# EAGLE design rx08-ulrich (EAGLE 6.6.0)
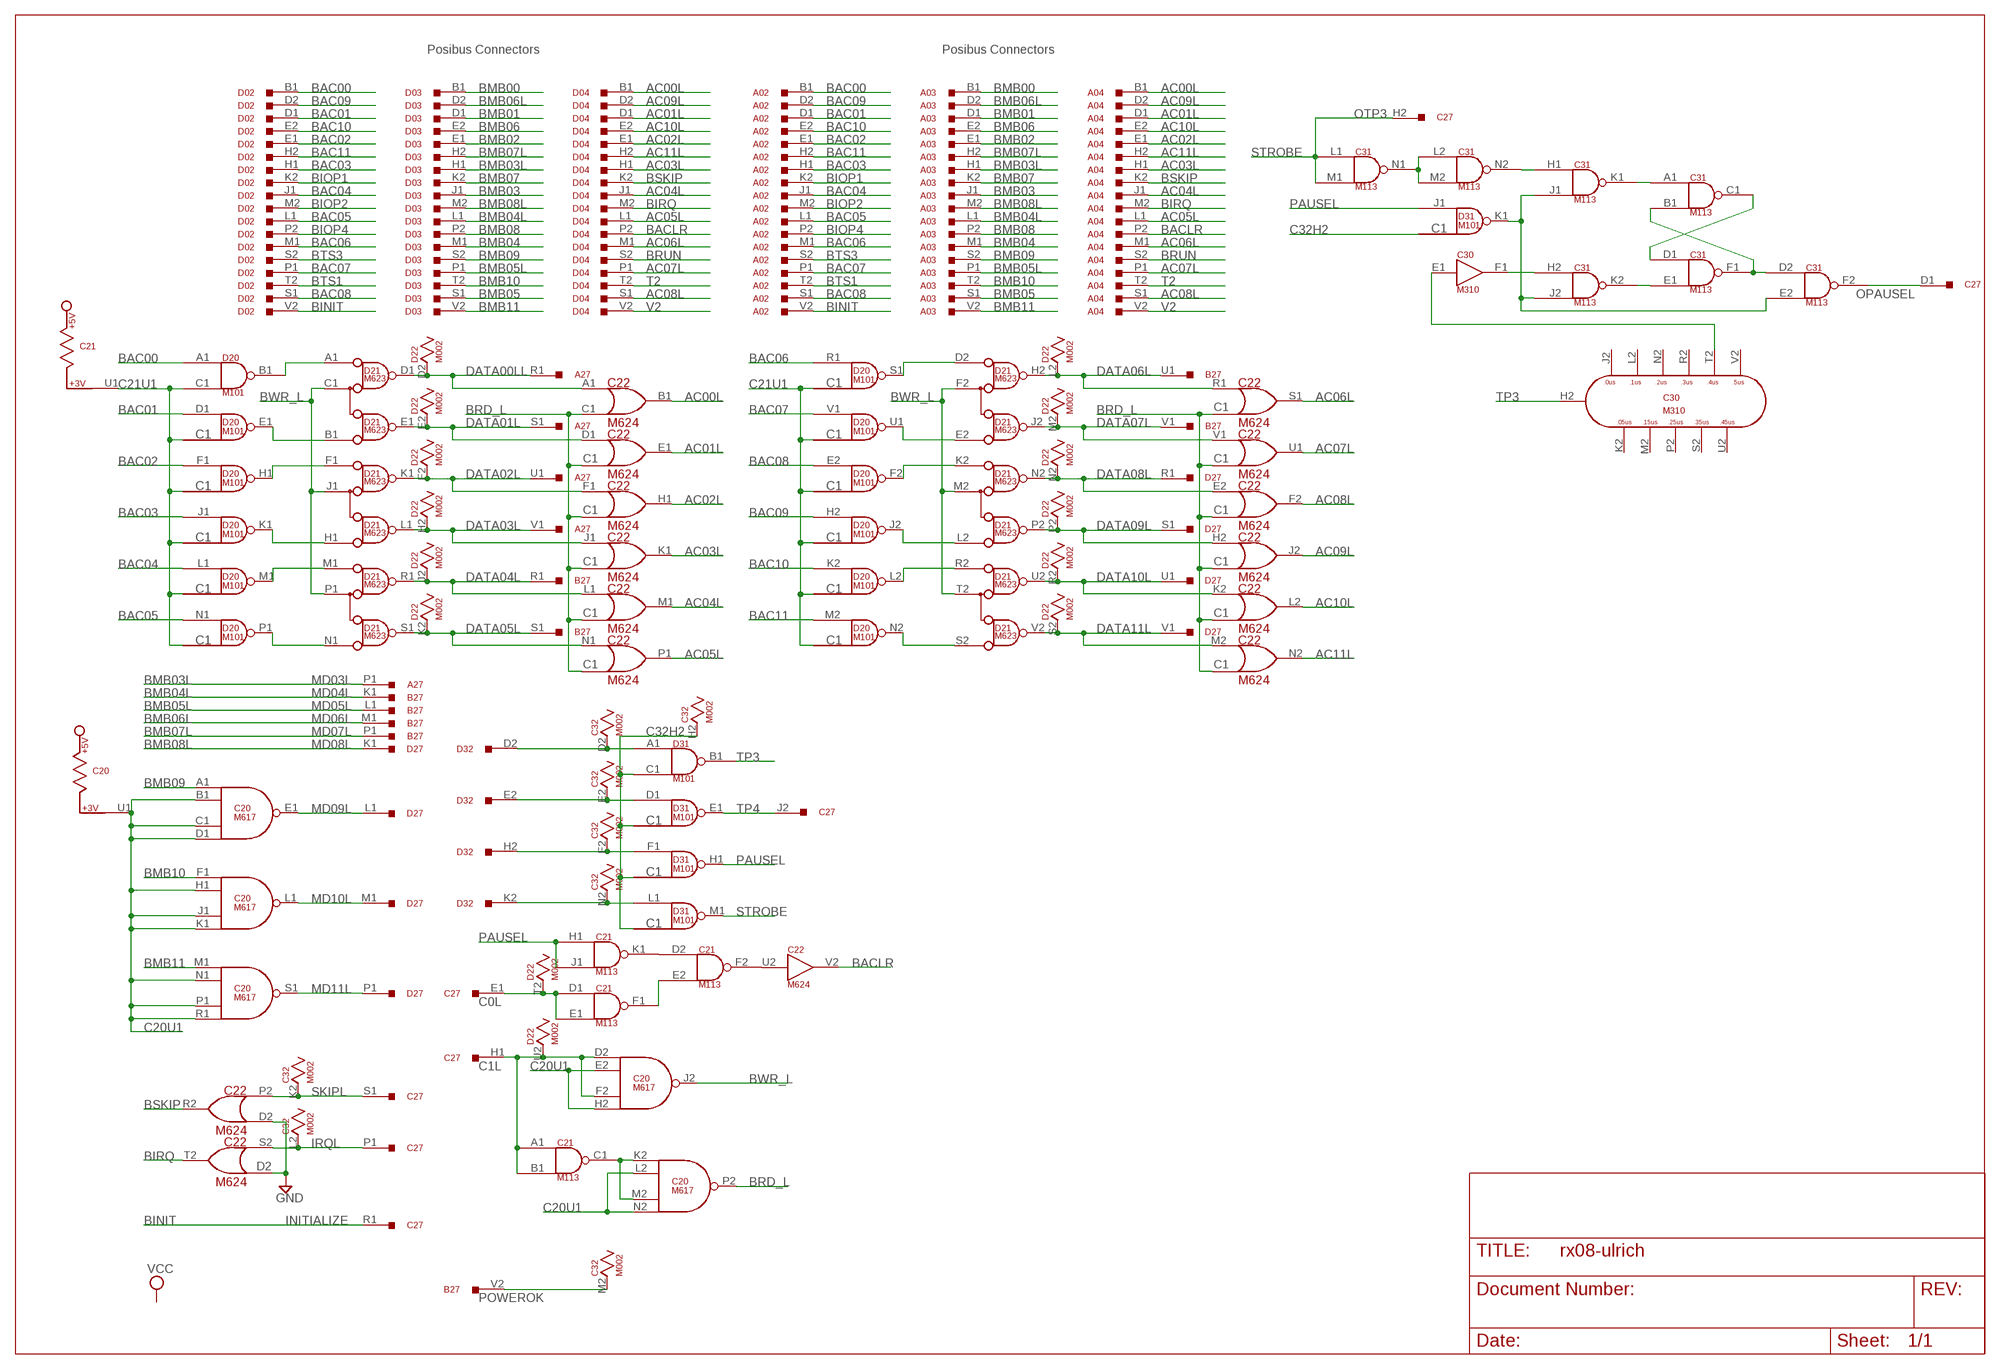
[diagram p0: schematic, sheet 1]

## Parts
A02  M903  [H807]
A03  M903  [H807]
A04  M903  [H807]
A27  M916  [H807]
B27  M916  [H807]
C20  M617  [H807]
C21  M113  [H807]
C22  M624  [H807]
C27  M916  [H807]
C30  M310  [H807]
C31  M113  [H807]
C32  M002  [H807]
D02  M903  [H807]
D03  M903  [H807]
D04  M903  [H807]
D20  M101  [H807]
D21  M623  [H807]
D22  M002  [H807]
D27  M916  [H807]
D31  M101  [H807]
D32  M903  [H807]

## Nets
AC00L: A04.B1 C22.B1(B1:OUT) D04.B1
AC01L: A04.D1 C22.E1(E1:OUT) D04.D1
AC02L: A04.E1 C22.H1(H1:OUT) D04.E1
AC03L: A04.H1 C22.K1(K1:OUT) D04.H1
AC04L: A04.J1 C22.M1(M1:OUT) D04.J1
AC05L: A04.L1 C22.P1(P1:OUT) D04.L1
AC06L: A04.M1 C22.S1(S1:OUT) D04.M1
AC07L: A04.P1 C22.U1(U1:OUT) D04.P1
AC08L: A04.S1 C22.F2(F2:OUT) D04.S1
AC09L: A04.D2 C22.J2(J2:OUT) D04.D2
AC10L: A04.E2 C22.L2(L2:OUT) D04.E2
AC11L: A04.H2 C22.N2(N2:OUT) D04.H2
BAC00: A02.B1 D02.B1 D20.A1(B1:IN1)
BAC01: A02.D1 D02.D1 D20.D1(E1:IN)
BAC02: A02.E1 D02.E1 D20.F1(H1:IN)
BAC03: A02.H1 D02.H1 D20.J1(K1:IN)
BAC04: A02.J1 D02.J1 D20.L1(M1:IN)
BAC05: A02.L1 D02.L1 D20.N1(P1:IN)
BAC06: A02.M1 D02.M1 D20.R1(S1:IN)
BAC07: A02.P1 D02.P1 D20.V1(U1:IN)
BAC08: A02.S1 D02.S1 D20.E2(F2:IN)
BAC09: A02.D2 D02.D2 D20.H2(J2:IN)
BAC10: A02.E2 D02.E2 D20.K2(L2:IN)
BAC11: A02.H2 D02.H2 D20.M2(N2:IN)
BACLR: A04.P2 C22.V2(V2:OUT) D04.P2
BINIT: A02.V2 C27.R1 D02.V2
BIOP1: A02.K2 D02.K2
BIOP2: A02.M2 D02.M2
BIOP4: A02.P2 D02.P2
BIRQ: A04.M2 C22.T2(T2:OUT) D04.M2
BMB00: A03.B1 D03.B1
BMB01: A03.D1 D03.D1
BMB02: A03.E1 D03.E1
BMB03: A03.J1 D03.J1
BMB03L: A03.H1 A27.P1 D03.H1
BMB04: A03.M1 D03.M1
BMB04L: A03.L1 B27.K1 D03.L1
BMB05: A03.S1 D03.S1
BMB05L: A03.P1 B27.L1 D03.P1
BMB06: A03.E2 D03.E2
BMB06L: A03.D2 B27.M1 D03.D2
BMB07: A03.K2 D03.K2
BMB07L: A03.H2 B27.P1 D03.H2
BMB08: A03.P2 D03.P2
BMB08L: A03.M2 D03.M2 D27.K1
BMB09: A03.S2 C20.A1(E1:IN1) D03.S2
BMB10: A03.T2 C20.F1(L1:IN1) D03.T2
BMB11: A03.V2 C20.M1(S1:IN1) D03.V2
BRD_L: C20.P2(P2:OUT) C22.C1(B1:IN2)
BRUN: A04.S2 D04.S2
BSKIP: A04.K2 C22.R2(R2:OUT) D04.K2
BTS1: A02.T2 D02.T2
BTS3: A02.S2 D02.S2
BWR_L: C20.J2(J2:OUT) D21.C1(D1:C) D21.F2(H2:C) D21.J1(K1:C) D21.M2(N2:C) D21.P1(R1:C) D21.T2(U2:C)
C0L: C21.D1(F1:IN1) C21.E1(F1:IN2) C27.E1 D22.T2
C1L: C20.D2(J2:IN1) C20.F2(J2:IN3) C21.A1(C1:IN1) C21.B1(C1:IN2) C27.H1 D22.U2
C20U1: C20.B1(E1:IN2) C20.C1(E1:IN3) C20.D1(E1:IN4) C20.E2(J2:IN2) C20.H1(L1:IN2) C20.H2(J2:IN4) C20.J1(L1:IN3) C20.K1(L1:IN4) C20.L2(P2:IN2) C20.N1(S1:IN2) C20.N2(P2:IN4) C20.P1(S1:IN3) C20.R1(S1:IN4) C20.U1
C21U1: C21.U1 D20.C1(B1:IN2)
C32H2: C32.H2 D31.C1(B1:IN2)
DATA00LL: A27.R1 C22.A1(B1:IN1) D21.D1(D1:D) D22.D2
DATA01L: A27.S1 C22.D1(E1:IN) D21.E1(D1:E) D22.E2
DATA02L: A27.U1 C22.F1(H1:IN) D21.K1(K1:D) D22.F2
DATA03L: A27.V1 C22.J1(K1:IN) D21.L1(K1:E) D22.H2
DATA04L: B27.R1 C22.L1(M1:IN) D21.R1(R1:D) D22.J2
DATA05L: B27.S1 C22.N1(P1:IN) D21.S1(R1:E) D22.K2
DATA06L: B27.U1 C22.R1(S1:IN) D21.H2(H2:D) D22.L2
DATA07L: B27.V1 C22.V1(U1:IN) D21.J2(H2:E) D22.M2
DATA08L: C22.E2(F2:IN) D21.N2(N2:D) D22.N2 D27.R1
DATA09L: C22.H2(J2:IN) D21.P2(N2:E) D22.P2 D27.S1
DATA10L: C22.K2(L2:IN) D21.U2(U2:D) D22.R2 D27.U1
DATA11L: C22.M2(N2:IN) D21.V2(U2:E) D22.S2 D27.V1
GND: C22.D2(R2:IN2)
IRQL: C22.S2(T2:IN) C27.P1 C32.L2
MD09L: C20.E1(E1:OUT) D27.L1
MD10L: C20.L1(L1:OUT) D27.M1
MD11L: C20.S1(S1:OUT) D27.P1
N$1: D20.B1(B1:OUT) D21.A1(D1:A)
N$2: D20.E1(E1:OUT) D21.B1(D1:B)
N$3: D20.H1(H1:OUT) D21.F1(K1:A)
N$4: D20.K1(K1:OUT) D21.H1(K1:B)
N$5: D20.P1(P1:OUT) D21.N1(R1:B)
N$6: D20.M1(M1:OUT) D21.M1(R1:A)
N$7: C20.K2(P2:IN1) C20.M2(P2:IN3) C21.C1(C1:OUT)
N$8: D20.N2(N2:OUT) D21.S2(U2:B)
N$9: C32.D2 D31.A1(B1:IN1) D32.D2
N$10: D20.J2(J2:OUT) D21.L2(N2:B)
N$11: D20.U1(U1:OUT) D21.E2(H2:B)
N$12: D20.S1(S1:OUT) D21.D2(H2:A)
N$13: D20.F2(F2:OUT) D21.K2(N2:A)
N$14: D20.L2(L2:OUT) D21.R2(U2:A)
N$15: C32.E2 D31.D1(E1:IN) D32.E2
N$16: C32.F2 D31.F1(H1:IN) D32.H2
N$17: C32.N2 D31.L1(M1:IN) D32.K2
N$18: C31.E2(F2:IN2) C31.J1(K1:IN2) C31.J2(K2:IN2) D31.K1(K1:OUT)
N$19: C21.E2(F2:IN2) C21.F1(F1:OUT)
N$20: C21.D2(F2:IN1) C21.K1(K1:OUT)
N$21: C31.C1(C1:OUT) C31.D1(F1:IN1)
N$22: C31.B1(C1:IN2) C31.D2(F2:IN1) C31.F1(F1:OUT)
N$23: C21.F2(F2:OUT) C22.U2(V2:IN)
N$24: C30.E1(F1:IN) C30.T2(H2:T2)
N$25: C30.F1(F1:OUT) C31.H2(K2:IN1)
N$26: C31.L2(N2:IN1) C31.M2(N2:IN2) C31.N1(N1:OUT)
N$28: C31.H1(K1:IN1) C31.N2(N2:OUT)
N$29: C31.A1(C1:IN1) C31.K1(K1:OUT)
N$30: C31.E1(F1:IN2) C31.K2(K2:OUT)
OPAUSEL: C27.D1 C31.F2(F2:OUT)
PAUSEL: C21.H1(K1:IN1) C21.J1(K1:IN2) D31.H1(H1:OUT) D31.J1(K1:IN)
POWEROK: B27.V2 C32.M2
SKIPL: C22.P2(R2:IN1) C27.S1 C32.K2
STROBE: C27.H2 C31.L1(N1:IN1) C31.M1(N1:IN2) D31.M1(M1:OUT)
T2: A04.T2 D04.T2
TP3: C30.H2(H2:H2) D31.B1(B1:OUT)
TP4: C27.J2 D31.E1(E1:OUT)
V2: A04.V2 D04.V2
Unconnected: A27.A1 A27.A2 A27.B1 A27.B2 A27.C1 A27.C2 A27.D1 A27.D2 A27.E1 A27.E2 A27.F1 A27.F2 A27.H1 A27.H2 A27.J1 A27.J2 A27.K1 A27.K2 A27.L1 A27.L2 A27.M1 A27.M2 A27.N1 A27.N2 A27.P2 A27.R2 A27.S2 A27.T1 A27.T2 A27.U2 A27.V2 B27.A1 B27.A2 B27.B1 B27.B2 B27.C1 B27.C2 B27.D1 B27.D2 B27.E1 B27.E2 B27.F1 B27.F2 B27.H1 B27.H2 B27.J1 B27.J2 B27.K2 B27.L2 B27.M2 B27.N1 B27.N2 B27.P2 B27.R2 B27.S2 B27.T1 B27.T2 B27.U2 C20.R2(V2:IN1) C20.S2(V2:IN2) C20.T2(V2:IN3) C20.U2(V2:IN4) C20.V1 C20.V2(V2:OUT) C21.H2(K2:IN1) C21.J2(K2:IN2) C21.K2(K2:OUT) C21.L1(N1:IN1) C21.L2(N2:IN1) C21.M1(N1:IN2) C21.M2(N2:IN2) C21.N1(N1:OUT) C21.N2(N2:OUT) C21.P1(S1:IN1) C21.P2(S2:IN1) C21.R1(S1:IN2) C21.R2(S2:IN2) C21.S1(S1:OUT) C21.S2(S2:OUT) C21.T2(V2:IN1) C21.U2(V2:IN2) C21.V1 C21.V2(V2:OUT) C27.A1 C27.A2 C27.B1 C27.B2 C27.C1 C27.C2 C27.D2 C27.E2 C27.F1 C27.F2 C27.J1 C27.K1 C27.K2 C27.L1 C27.L2 C27.M1 C27.M2 C27.N1 C27.N2 C27.P2 C27.R2 C27.S2 C27.T1 C27.T2 C27.U1 C27.U2 C27.V1 C27.V2 C30.H1(J1:IN) C30.J1(J1:OUT) C30.J2(H2:J2) C30.K2(H2:K2) C30.L2(H2:L2) C30.M2(H2:M2) C30.N2(H2:N2) C30.P2(H2:P2) C30.R2(H2:R2) C30.S2(H2:S2) C30.U2(H2:U2) C30.V2(H2:V2) C31.P1(S1:IN1) C31.P2(S2:IN1) C31.R1(S1:IN2) C31.R2(S2:IN2) C31.S1(S1:OUT) C31.S2(S2:OUT) C31.T2(V2:IN1) C31.U1 C31.U2(V2:IN2) C31.V1 C31.V2(V2:OUT) C32.J2 C32.P2 C32.R2 C32.S2 C32.T2 C32.U2 C32.V2 D20.P2(R2:IN) D20.R2(R2:OUT) D20.S2(T2:IN) D20.T2(T2:OUT) D20.U2(V2:IN) D20.V2(V2:OUT) D22.V2 D27.A1 D27.A2 D27.B1 D27.B2 D27.C1 D27.C2 D27.D1 D27.D2 D27.E1 D27.E2 D27.F1 D27.F2 D27.H1 D27.H2 D27.J1 D27.J2 D27.K2 D27.L2 D27.M2 D27.N1 D27.N2 D27.P2 D27.R2 D27.S2 D27.T1 D27.T2 D27.U2 D27.V2 D31.E2(F2:IN) D31.F2(F2:OUT) D31.H2(J2:IN) D31.J2(J2:OUT) D31.K2(L2:IN) D31.L2(L2:OUT) D31.M2(N2:IN) D31.N1(P1:IN) D31.N2(N2:OUT) D31.P1(P1:OUT) D31.P2(R2:IN) D31.R1(S1:IN) D31.R2(R2:OUT) D31.S1(S1:OUT) D31.S2(T2:IN) D31.T2(T2:OUT) D31.U1(U1:OUT) D31.U2(V2:IN) D31.V1(U1:IN) D31.V2(V2:OUT) D32.B1 D32.D1 D32.E1 D32.H1 D32.J1 D32.L1 D32.M1 D32.M2 D32.P1 D32.P2 D32.S1 D32.S2 D32.T2 D32.V2

## Notes on the sheet
- Posibus Connectors | Posibus Connectors
- OTP3
- MD03L
- MD04L
- MD05L
- MD06L
- MD07L
- MD08L
- INITIALIZE

## Power pins joined to a net without a drawn wire
GND: A02.A1 A02.C1 A02.C2 A02.F1 A02.F2 A02.J2 A02.K1 A02.L2 A02.N1 A02.N2 A02.R1 A02.R2 A02.T1 A02.U2 A03.A1 A03.C1 A03.C2 A03.F1 A03.F2 A03.J2 A03.K1 A03.L2 A03.N1 A03.N2 A03.R1 A03.R2 A03.T1 A03.U2 A04.A1 A04.C1 A04.C2 A04.F1 A04.F2 A04.J2 A04.K1 A04.L2 A04.N1 A04.N2 A04.R1 A04.R2 A04.T1 A04.U2 C20.C2(GND) C20.T1(GND) C21.C2(GND) C21.T1(GND) C22.C2(GND) C22.T1(GND) C30.C2(GND) C30.T1(GND) C31.C2(GND) C31.T1(GND) C32.C2(GND) D02.A1 D02.C1 D02.C2 D02.F1 D02.F2 D02.J2 D02.K1 D02.L2 D02.N1 D02.N2 D02.R1 D02.R2 D02.T1 D02.U2 D03.A1 D03.C1 D03.C2 D03.F1 D03.F2 D03.J2 D03.K1 D03.L2 D03.N1 D03.N2 D03.R1 D03.R2 D03.T1 D03.U2 D04.A1 D04.C1 D04.C2 D04.F1 D04.F2 D04.J2 D04.K1 D04.L2 D04.N1 D04.N2 D04.R1 D04.R2 D04.T1 D04.U2 D20.C2(GND) D20.T1(GND) D21.C2(GND) D21.T1(GND) D21.U1(GND) D21.V1(GND) D22.C2(GND) D31.C2(GND) D31.T1(GND) D32.A1 D32.C1 D32.C2 D32.F1 D32.F2 D32.J2 D32.K1 D32.L2 D32.N1 D32.N2 D32.R1 D32.R2 D32.T1 D32.U2
VCC: C20.A2(VCC) C21.A2(VCC) C22.A2(VCC) C30.A2(VCC) C31.A2(VCC) C32.A2(VCC) D20.A2(VCC) D21.A2(VCC) D22.A2(VCC) D31.A2(VCC)

## Library data of the parts
A02-A04 D02-D04 D32 = dec-m:M903: Two-sided Posibus cable/connector.
A27 B27 C27 D27 = dec-m:M916: Simple 36 pin connector/wire cable
C20 = dec-m:M617: 6 4-input NAND Buffers
C21 C31 = dec-m:M113: 10 2-input NAND Gates
C22 = dec-m:M624: Bus Data Interface The M101 contains 15 two-input NAND gates. One input of each gate is tied to a common line so that all data signals can be enabled simultaneously. Each data signal presents one TTL load. The common input presents 15 loads. Each output can drive 10 loads. Power: 5V@82ma (max.)
C30 = dec-m:M310: Tapped Delay Line
C32 D22 = dec-m:M002: 15 Clamped Loads
D20 D31 = dec-m:M101: Bus Data Interface The M101 contains 15 two-input NAND gates. One input of each gate is tied to a common line so that all data signals can be enabled simultaneously. Each data signal presents one TTL load. The common input presents 15 loads. Each output can drive 10 loads. Power: 5V@82ma (max.)
D21 = dec-m:M623: 6 Dual Bus Drivers

## Net classes
1 Supply: width 1.905 mm, clearance 0.508 mm

## Board
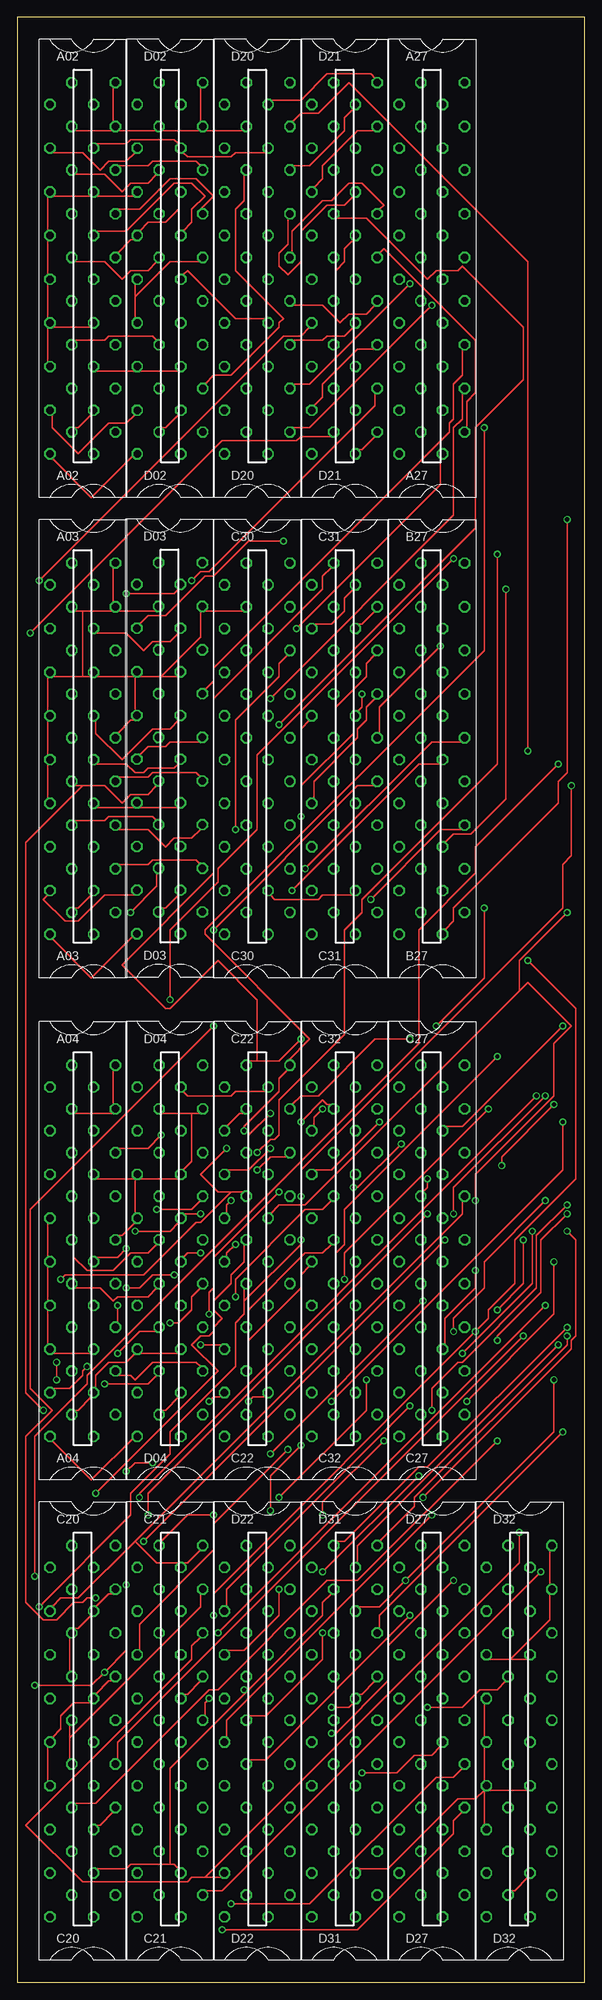
[diagram p1: board, top side]
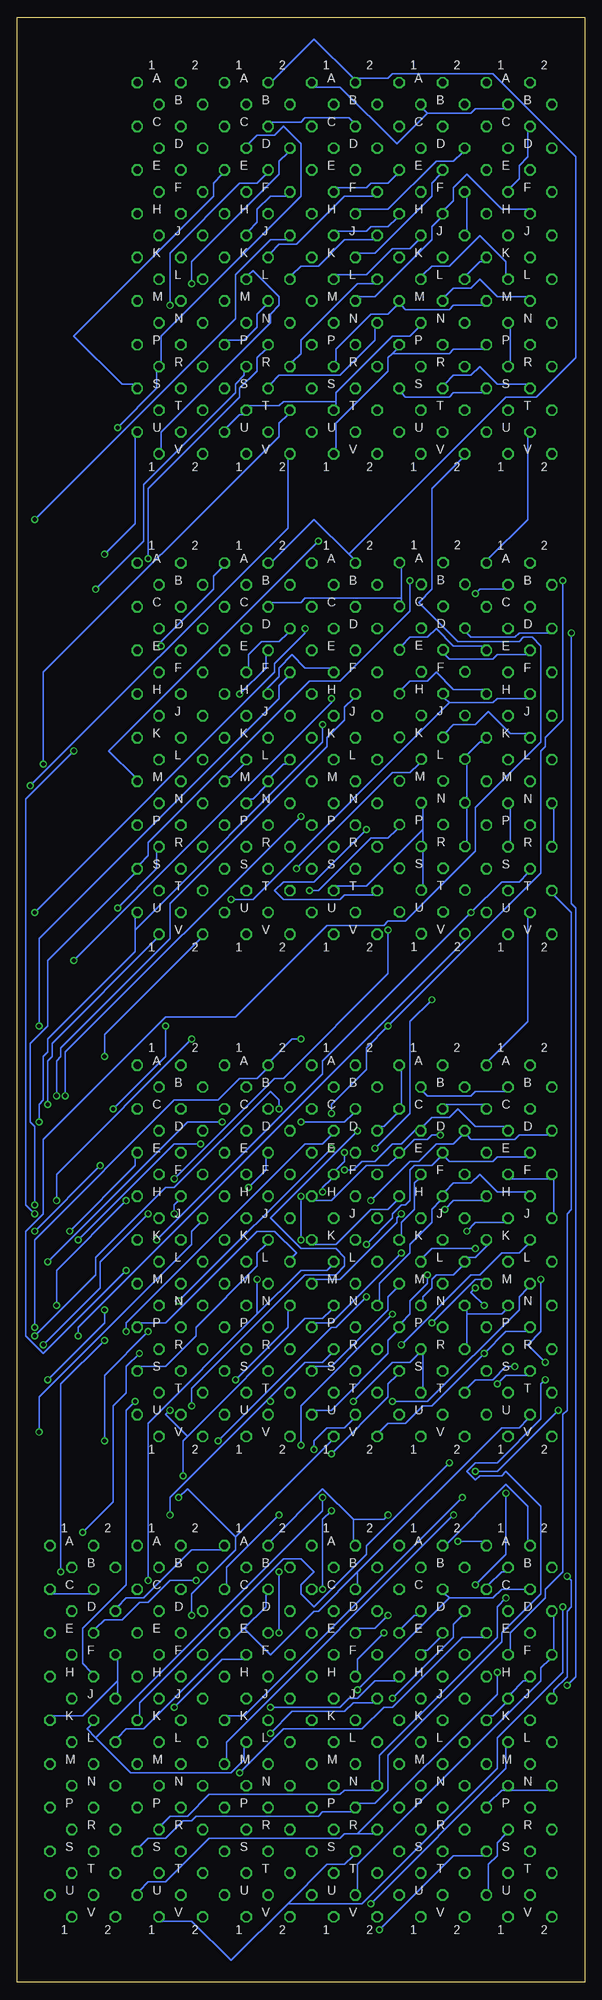
[diagram p2: board, bottom side, seen from below]

Size 82.55 x 285.75 mm. Coordinates in mm from the lower left corner, seen from the top.
Outline: 0,0 82.55,0 82.55,285.75 0,285.75 0,0
Copper layers (1*16): Top 0.035mm / dielectric 1.5mm / Bottom 0.035mm
Design rules "olimex10mil": minimum track width 10mil, minimum drill 24mil, track to track 10mil, track to pad 10mil, pad to pad 10mil, via to via 10mil, smd to smd 10mil, copper to edge 40mil, drill to drill 10mil, minimum pad ring 10mil, minimum via ring 8mil, stop-mask expansion 0mil, vias tented up to drill 0mil, thermal gap 10mil

### Footprints (pad centres in the part's own frame; a part is rotated, then mirrored left to right if it is on the bottom)
H807 = drill 1.092 octagon: A1 4.763,28.575; A2 -1.587,28.575; B1 1.587,25.4; B2 -4.763,25.4; C1 4.763,22.225; C2 -1.587,22.225; D1 1.587,19.05; D2 -4.763,19.05; E1 4.763,15.875; E2 -1.587,15.875; F1 1.587,12.7; F2 -4.763,12.7; H1 4.763,9.525; H2 -1.587,9.525; J1 1.587,6.35; J2 -4.763,6.35; K1 4.763,3.175; K2 -1.587,3.175; L1 1.587,0; L2 -4.763,0; M1 4.763,-3.175; M2 -1.587,-3.175; N1 1.587,-6.35; N2 -4.763,-6.35; P1 4.763,-9.525; P2 -1.587,-9.525; R1 1.587,-12.7; R2 -4.763,-12.7; S1 4.763,-15.875; S2 -1.587,-15.875; T1 1.587,-19.05; T2 -4.763,-19.05; U1 4.763,-22.225; U2 -1.587,-22.225; V1 1.587,-25.4; V2 -4.763,-25.4

### Placement (x,y rotation side)
A02  9.53,247.65 0 top
A03  9.53,177.8 0 top
A04  9.53,104.78 0 top
A27  60.33,247.65 0 top
B27  60.33,177.8 0 top
C20  9.53,34.92 0 top
C21  22.23,34.92 0 top
C22  34.92,104.78 0 top
C27  60.33,104.78 0 top
C30  34.92,177.8 0 top
C31  47.62,177.8 0 top
C32  47.62,104.78 0 top
D02  22.23,247.65 0 top
D03  22.16,177.86 0 top
D04  22.23,104.78 0 top
D20  34.92,247.65 0 top
D21  47.62,247.65 0 top
D22  34.92,34.92 0 top
D27  60.33,34.92 0 top
D31  47.62,34.92 0 top
D32  73.03,34.92 0 top

### Tracks (layer width: path | path; a pad name or v marks a point on that pad's centre or on a via)
AC00L
  Top 0.254: C22.B1 36.2,129.54 31.75,129.54 31.11,128.91 24.77,128.91 24.13,129.54 D04.B1
  Bottom 0.254: A04.B1 11.43,129.54 15.88,129.54 16.51,128.91 22.86,128.91 23.5,129.54 D04.B1
AC01L  (via drill 0.61)
  Top 0.254: v34.92,118.11 36.83,120.02 39.37,120.02 C22.E1
  Bottom 0.254: A04.D1 11.43,124.46 15.88,124.46 18.41,127 19.68,125.73 22.23,125.73 23.5,124.46 D04.D1 24.13,124.46 26.67,121.92 27.94,121.92 30.48,119.38 32.38,119.38 33.66,118.11 v34.92,118.11
AC02L  (via drill 0.61)
  Top 0.254: v20.95,123.19 19.05,121.28 14.61,121.28 A04.E1
  Bottom 0.254: v20.95,123.19 22.23,123.19 22.86,122.56 24.77,122.56 26.67,120.65 D04.E1 27.3,120.02 28.57,118.75 31.75,118.75 36.83,113.67 39.37,113.67 C22.H1
AC03L  (via drill 0.61)
  Top 0.254: v20.32,112.39 25.4,112.39 26.67,113.67 D04.H1
  Bottom 0.254: v20.32,112.39 19.05,113.67 14.61,113.67 A04.H1 | C22.K1 39.37,107.31 36.2,107.31 31.11,112.39 28.57,112.39 27.3,113.67 D04.H1
AC04L  (via drill 0.61)
  Top 0.254: v17.14,109.22 22.23,109.22 23.5,110.49 D04.J1 24.13,111.76 v26.67,111.76
  Bottom 0.254: v17.14,109.22 15.88,110.49 11.43,110.49 A04.J1 | v26.67,111.76 27.3,111.12 27.3,110.49 35.56,102.23 39.37,102.23 C22.M1
AC05L  (via drill 0.61)
  Top 0.254: v15.88,106.68 14.61,105.41 11.43,105.41 A04.L1 | v26.67,106.05 24.77,106.05 24.13,105.41 D04.L1
  Bottom 0.254: v15.88,106.68 22.23,106.68 23.5,105.41 D04.L1 | v26.67,106.05 36.83,95.89 39.37,95.89 C22.P1
AC06L  (via drill 0.61)
  Top 0.254: v22.23,95.89 23.5,95.89 25.4,97.79 25.4,99.69 26.67,100.97 D04.M1
  Bottom 0.254: v22.23,95.89 15.88,102.23 14.61,102.23 A04.M1 | C22.S1 39.37,89.53 36.83,89.53 28.57,97.79 28.57,99.69 27.3,100.97 D04.M1
AC07L  (via drill 0.61)
  Top 0.254: v14.61,98.42 14.61,95.89 A04.P1 | v15.88,100.97 17.78,100.97 19.68,102.87 v22.86,102.87
  Bottom 0.254: v14.61,98.42 16.51,100.33 v15.88,100.97 | v22.86,102.87 22.86,101.6 25.4,99.06 25.4,97.16 26.67,95.89 D04.P1 27.3,94.61 28.57,93.34 28.57,91.44 36.83,83.19 39.37,83.19 C22.U1
AC08L  (via drill 0.61)
  Top 0.254: A04.S1 14.61,88.27 16.51,88.27 17.14,87.63 19.68,90.17 26.04,90.17 26.67,89.53 D04.S1 | v36.83,121.28 33.66,118.11 30.48,118.11 C22.F2 | v36.83,76.83 v59.05,99.06
  Bottom 0.254: v59.05,99.06 v36.83,121.28 | v36.83,76.83 28.57,85.09 28.57,87 27.3,88.27 D04.S1
AC09L  (via drill 0.61)
  Top 0.254: v31.11,113.67 30.48,113.03 30.48,111.76 C22.J2
  Bottom 0.254: A04.D2 5.08,123.19 9.53,123.19 10.16,122.56 16.51,122.56 17.14,123.19 D04.D2 17.78,123.19 19.05,121.92 21.59,121.92 24.13,119.38 25.4,119.38 v31.11,113.67
AC10L  (via drill 0.61)
  Top 0.254: v31.75,107.31 30.48,106.05 30.48,105.41 C22.L2
  Bottom 0.254: A04.E2 8.26,120.02 12.7,120.02 13.34,119.38 19.68,119.38 20.32,120.02 D04.E2 20.95,120.02 22.23,118.75 24.77,118.75 25.4,118.11 25.4,113.67 26.04,113.03 26.67,113.03 27.94,111.76 27.94,111.12 v31.75,107.31
AC11L
  Bottom 0.254: A04.H2 8.26,114.94 12.7,114.94 15.24,117.47 16.51,116.2 19.05,116.2 20.32,114.94 D04.H2 20.95,113.67 22.23,112.39 22.23,110.49 25.4,107.31 25.4,106.05 29.84,101.6 29.84,99.06 C22.N2
BAC00
  Bottom 0.254: 22.86,271.78 16.51,271.78 15.88,272.42 11.43,272.42 A02.B1 | 22.86,271.78 23.5,272.42 D02.B1 | 22.86,271.78 27.3,267.33 35.56,275.59 39.37,275.59 D20.A1
BAC01
  Top 0.254: A02.D1 11.43,267.33 15.88,267.33 16.51,267.97 22.86,267.97 23.5,267.33 D02.D1 24.13,266.06 24.77,265.43 31.11,265.43 31.75,266.06 36.2,266.06 D20.D1
BAC02
  Top 0.254: A02.E1 14.61,264.16 19.05,264.16 19.68,264.8 26.04,264.8 26.67,264.16 D02.E1
  Bottom 0.254: D20.F1 36.2,260.99 31.75,260.99 31.11,261.62 28.57,261.62 27.3,262.89 D02.E1
BAC03
  Top 0.254: A02.H1 14.61,257.81 17.78,257.81 22.23,262.25 26.04,262.25 28.57,259.71 26.67,257.81 D02.H1
  Bottom 0.254: D20.J1 36.2,254.63 31.75,254.63 31.11,255.27 28.57,255.27 27.3,256.54 D02.H1
BAC04
  Top 0.254: A02.J1 11.43,254.63 15.88,254.63 22.86,261.62 25.4,261.62 27.3,259.71 25.4,257.81 25.4,255.91 24.13,254.63 D02.J1
  Bottom 0.254: D20.L1 36.2,248.28 31.75,248.28 27.94,252.09 25.4,252.09 24.13,253.37 D02.J1
BAC05
  Top 0.254: D20.N1 36.2,241.94 31.75,241.94 24.77,248.92 24.13,248.28 D02.L1
  Bottom 0.254: A02.L1 11.43,248.28 11.43,250.19 15.24,254 19.68,249.56 22.23,249.56 23.5,248.28 D02.L1
BAC06
  Bottom 0.254: A02.M1 14.61,243.84 19.05,243.84 19.68,243.21 26.04,243.21 26.67,243.84 D02.M1 27.3,243.84 28.57,242.57 31.11,242.57 36.2,237.49 36.2,235.59 D20.R1
BAC07
  Bottom 0.254: 27.94,236.85 27.3,237.49 D02.P1 | 27.94,236.85 28.57,236.22 28.57,234.31 36.2,226.69 36.2,222.88 D20.V1 | 27.94,236.85 19.68,236.85 19.05,237.49 14.61,237.49 A02.P1
BAC08
  Top 0.254: D20.E2 33.02,262.89 33.02,259.08 31.75,257.81 31.75,248.92 38.73,241.94 38.1,241.3 38.1,240.66 31.11,233.68 28.57,233.68 27.3,232.41 D02.S1
  Bottom 0.254: A02.S1 14.61,231.14 19.05,231.14 19.68,230.5 26.04,230.5 26.67,231.14 D02.S1
BAC09
  Top 0.254: A02.D2 5.08,266.06 9.53,266.06 12.06,263.52 13.34,264.8 15.88,264.8 17.14,266.06 D02.D2
  Bottom 0.254: D20.H2 33.02,257.81 28.57,257.81 21.59,264.8 19.05,264.8 17.78,266.06 D02.D2
BAC10
  Top 0.254: A02.E2 8.26,262.89 12.7,262.89 15.24,260.35 16.51,261.62 19.05,261.62 20.32,262.89 D02.E2
  Bottom 0.254: D20.K2 33.02,251.46 30.48,251.46 22.23,259.71 22.23,261.62 20.95,262.89 D02.E2
BAC11
  Bottom 0.254: A02.H2 8.26,257.81 12.06,257.81 17.14,262.89 19.05,260.99 19.05,259.08 20.32,257.81 D02.H2 20.95,256.54 22.23,255.27 22.23,253.37 30.48,245.11 33.02,245.11 D20.M2
BACLR  (via drill 0.61)
  Top 0.254: v14.61,91.44 17.78,94.61 20.32,94.61 D04.P2
  Bottom 0.254: A04.P2 8.26,94.61 11.43,94.61 v14.61,91.44 22.23,83.82 23.5,83.82 26.04,81.28 28.57,81.28 29.84,80.01 C22.V2
BINIT  (via drill 0.61)
  Top 0.254: v66.67,103.5 66.67,100.97 62.23,96.52 62.23,92.71 C27.R1 | A02.V2 5.08,221.62 10.79,215.9 17.14,222.25 D02.V2
  Bottom 0.254: v66.67,103.5 78.74,91.44 81.28,93.98 81.28,109.22 78.74,111.76 78.74,122.56 60.96,140.34 50.8,140.34 37.47,153.67 29.21,153.67 28.57,154.31 26.04,154.31 15.88,164.47 15.88,170.81 6.35,180.34 6.35,194.31 7.62,195.58 8.89,195.58 9.53,194.94 18.41,194.94 24.13,200.66 22.23,202.56 22.23,217.17 17.78,221.62 D02.V2
BIOP1
  Top 0.254: A02.K2 8.26,250.19 12.7,250.19 15.24,247.65 16.51,248.92 19.05,248.92 20.32,250.19 D02.K2
BIOP2
  Bottom 0.254: A02.M2 8.26,245.11 12.7,245.11 15.24,247.65 16.51,246.38 19.05,246.38 20.32,245.11 D02.M2
BIOP4
  Top 0.254: A02.P2 8.26,238.76 12.7,238.76 13.34,239.4 19.68,239.4 20.32,238.76 D02.P2
BIRQ  (via drill 0.61)
  Top 0.254: A04.M2 8.26,100.97 12.06,100.97 13.97,99.06 14.61,99.69 19.05,99.69 20.32,100.97 D04.M2 | v27.94,84.45 28.57,85.09 29.84,85.09 C22.T2
  Bottom 0.254: v27.94,84.45 22.86,84.45 9.53,97.79 9.53,99.69 8.26,100.97 A04.M2
BMB00  (via drill 0.61)
  Top 0.254: v15.88,201.93 22.86,201.93 23.5,202.56 D03.B1
  Bottom 0.254: v15.88,201.93 15.24,202.56 11.43,202.56 A03.B1
BMB01
  Top 0.254: A03.D1 11.43,196.22 15.88,196.22 18.41,193.68 19.68,194.94 22.23,194.94 23.5,196.22 D03.D1
BMB02
  Bottom 0.254: A03.E1 14.61,194.31 19.05,194.31 21.59,196.85 22.86,195.58 25.4,195.58 26.67,194.31 D03.E1
BMB03
  Top 0.254: A03.J1 11.43,183.51 11.43,181.61 15.24,177.8 19.68,182.25 22.23,182.25 23.5,183.51 D03.J1
BMB03L
  Top 0.254: A27.P1 64.77,237.49 64.77,233.68 63.5,232.41 63.5,227.33 62.87,226.69 62.87,225.43 28.57,191.13 28.57,189.23 27.3,187.96 D03.H1
  Bottom 0.254: A03.H1 14.61,187.96 19.05,187.96 21.59,190.5 22.86,189.23 25.4,189.23 26.67,187.96 D03.H1
BMB04
  Top 0.254: A03.M1 14.61,175.26 19.05,175.26 19.68,175.9 26.04,175.9 26.67,175.26 D03.M1
BMB04L  (via drill 0.61)
  Top 0.254: A03.L1 11.43,177.16 15.88,177.16 17.14,175.9 18.41,175.9 19.05,176.53 22.86,176.53 23.5,177.16 D03.L1 | v41.91,161.93 60.33,180.34 64.77,180.34 B27.K1
  Bottom 0.254: v41.91,161.93 27.94,175.9 25.4,175.9 24.13,177.16 D03.L1
BMB05
  Top 0.254: A03.S1 14.61,162.56 19.05,162.56 19.68,163.19 26.04,163.19 26.67,162.56 D03.S1
BMB05L  (via drill 0.61)
  Top 0.254: A03.P1 14.61,167.64 19.05,167.64 21.59,165.1 22.86,166.37 25.4,166.37 26.67,167.64 D03.P1 | v40.01,158.75 58.42,177.16 61.59,177.16 B27.L1
  Bottom 0.254: v40.01,158.75 38.73,158.75 31.11,166.37 28.57,166.37 27.3,167.64 D03.P1
BMB06
  Bottom 0.254: A03.E2 8.26,193.04 12.7,193.04 13.34,192.41 19.68,192.41 20.32,193.04 D03.E2
BMB06L  (via drill 0.61)
  Top 0.254: v38.73,209.55 33.66,209.55 28.57,204.47 27.3,204.47 21.59,198.75 19.05,198.75 17.78,197.49 D03.D2
  Bottom 0.254: A03.D2 5.08,196.22 9.53,196.22 10.16,195.58 16.51,195.58 17.14,196.22 D03.D2 | v38.73,209.55 69.22,179.07 65.41,175.26 B27.M1
BMB07
  Bottom 0.254: A03.K2 8.26,181.61 10.79,181.61 13.97,184.78 15.88,182.88 19.05,182.88 20.32,181.61 D03.K2
BMB07L  (via drill 0.61)
  Top 0.254: v51.44,157.48 61.59,167.64 64.77,167.64 B27.P1
  Bottom 0.254: 19.68,186.06 13.34,186.06 12.7,186.69 8.26,186.69 A03.H2 | 19.68,186.06 20.32,186.69 D03.H2 | v51.44,157.48 48.26,157.48 19.68,186.06
BMB08
  Top 0.254: A03.P2 8.26,168.91 12.7,168.91 13.34,169.54 19.68,169.54 20.32,168.91 D03.P2
BMB08L  (via drill 0.61)
  Top 0.254: 9.53,173.99 12.7,173.99 15.24,171.45 16.51,172.72 19.05,172.72 20.32,173.99 D03.M2 | 9.53,173.99 8.26,173.99 A03.M2 | v19.68,75.56 17.14,75.56 v15.88,74.3 | v3.81,83.19 1.27,85.72 1.27,165.74 9.53,173.99
  Bottom 0.254: v19.68,75.56 31.75,63.5 31.75,62.23 39.37,54.61 41.27,56.52 41.27,57.78 39.37,59.69 41.27,61.59 43.81,61.59 64.77,40.64 64.77,38.73 D27.K1 | v15.88,74.3 12.7,74.3 v3.81,83.19
BMB09  (via drill 0.61)
  Top 0.254: v18.41,64.14 v62.23,107.95 | v16.51,155.57 20.32,159.38 20.32,161.29 D03.S2
  Bottom 0.254: v18.41,64.14 14.61,64.14 C20.A1 | v62.23,107.95 38.1,132.08 38.1,133.99 v16.51,155.57 12.06,160.02 9.53,160.02 8.26,161.29 A03.S2
BMB10
  Top 0.254: D03.T2 17.14,158.12 12.7,158.12 8.89,154.31 6.99,154.31 3.81,157.48 4.45,158.12 A03.T2
  Bottom 0.254: C20.F1 10.79,48.26 10.79,50.8 5.71,55.88 5.71,57.15 3.17,59.69 3.17,82.55 2.54,83.19 2.54,111.76 1.91,112.39 1.91,155.57 4.45,158.12 A03.T2
BMB11  (via drill 0.61)
  Top 0.254: v73.66,93.98 14.61,34.92 14.61,32.38 C20.M1 | A03.V2 5.08,151.76 10.79,146.05 17.14,152.4 D03.V2
  Bottom 0.254: v73.66,93.98 73.66,95.25 17.14,151.76 D03.V2
BRD_L  (via drill 0.61)
  Top 0.254: v69.85,78.74 49.53,58.42 45.09,58.42 29.21,42.55 27.94,42.55 11.43,26.04 8.26,26.04 C20.P2 | v63.5,94.61 63.5,96.52 67.94,100.97 67.94,104.78 v76.83,113.67 | v57.15,137.16 52.07,137.16 43.81,128.91 41.27,128.91 40.01,127.64 C22.C1
  Bottom 0.254: v69.85,78.74 69.85,88.27 v63.5,94.61 | v76.83,113.67 76.83,117.47 v57.15,137.16
BRUN  (via drill 0.61)
  Top 0.254: v12.7,87 19.05,87 20.32,88.27 D04.S2
  Bottom 0.254: v12.7,87 11.43,88.27 8.26,88.27 A04.S2
BSKIP  (via drill 0.61)
  Top 0.254: A04.K2 8.26,107.31 8.26,105.41 10.16,103.5 13.97,103.5 16.51,106.05 19.05,106.05 20.32,107.31 D04.K2 | v26.67,92.71 29.84,92.71 C22.R2
  Bottom 0.254: v26.67,92.71 16.51,102.87 15.24,102.87 12.06,106.05 9.53,106.05 8.26,107.31 A04.K2
BTS1
  Top 0.254: A02.T2 5.08,227.97 5.08,226.06 8.89,222.25 13.34,226.69 15.88,226.69 17.14,227.97 D02.T2
BTS3
  Bottom 0.254: A02.S2 8.26,232.41 12.7,232.41 15.24,234.95 16.51,233.68 19.05,233.68 20.32,232.41 D02.S2
BWR_L  (via drill 0.61)
  Top 0.254: D21.C1 52.07,269.24 49.53,269.24 44.45,264.16 44.45,262.25 43.18,260.99 D21.F2 | D21.M2 46.35,245.11 46.35,248.92 47.62,250.19 47.62,252.09 48.9,253.37 D21.J1 | v2.54,59.05 2.54,79.38 10.16,87 10.16,88.27 58.42,136.53 58.42,153.03 66.67,161.29 66.67,165.1 v78.74,177.16 | D21.P1 52.07,237.49 49.53,237.49 44.45,232.41 44.45,230.5 43.18,229.24 D21.T2
  Bottom 0.254: D21.P1 52.07,238.76 49.53,238.76 47.62,240.66 47.62,242.57 46.35,243.84 D21.M2 | D21.F2 43.18,259.71 45.72,259.71 47.62,257.81 47.62,255.91 48.9,254.63 D21.J1 | v2.54,59.05 1.91,58.42 1.91,54.61 2.54,53.98 2.54,44.45 4.45,42.55 4.45,41.91 C20.J2 | v78.74,177.16 78.74,190.5 44.45,224.79 44.45,226.69 43.18,227.97 D21.T2
C0L  (via drill 0.61)
  Top 0.254: 27.3,15.24 25.4,15.24 24.77,14.61 9.53,14.61 1.27,22.86 25.4,46.99 25.4,48.9 26.67,50.16 C21.E1 | 27.3,15.24 29.84,15.24 D22.T2 | v74.93,109.22 74.93,101.6 v64.77,91.44 | v73.03,65.41 73.03,60.96 27.3,15.24
  Bottom 0.254: C21.D1 24.13,53.34 24.77,53.34 26.67,51.44 C21.E1 | v74.93,109.22 65.41,118.75 65.41,120.02 C27.E1 | v64.77,91.44 66.67,89.53 66.67,85.72 68.58,83.82 68.58,69.85 v73.03,65.41
C1L
  Top 0.254: C21.A1 26.67,62.87 24.77,60.96 24.13,60.96 C21.B1 23.5,60.96 20.32,60.96 17.14,64.14 | 17.14,64.14 8.89,55.88 6.35,55.88 5.08,54.61 C20.D2 | 17.14,64.14 64.77,111.76 64.77,113.67 C27.H1
  Bottom 0.254: C20.D2 4.45,53.34 4.45,48.26 C20.F2 5.08,46.99 6.35,45.72 6.35,43.81 33.02,17.14 33.02,13.34 D22.U2
C20U1
  Top 0.254: C20.H1 13.97,43.81 13.34,43.81 11.43,41.91 C20.J1 10.79,40.64 8.26,40.64 6.35,38.73 6.35,36.83 5.08,35.56 C20.L2 4.45,34.29 4.45,29.21 C20.N2 | C20.C1 13.97,56.52 13.34,56.52 11.43,54.61 C20.D1 10.79,53.34 8.89,51.44 8.26,51.44 C20.E2 7.62,50.16 7.62,45.09 C20.H2 | C20.R1 11.43,22.86 12.06,22.86 13.97,24.77 C20.P1
  Bottom 0.254: C20.H2 8.26,43.81 8.89,43.81 10.79,41.91 C20.J1 11.43,40.64 13.34,38.73 13.97,38.73 C20.K1 | C20.B1 11.43,59.69 12.06,59.69 13.97,57.78 C20.C1 | C20.U1 13.97,13.34 13.97,17.14 12.7,18.41 12.7,20.32 11.43,21.59 C20.R1 | C20.P1 13.97,26.04 12.06,27.94 11.43,27.94 C20.N1 10.79,27.94 5.08,27.94 C20.N2
C21U1  (via drill 0.61)
  Top 0.254: v76.2,59.69 29.84,13.34 27.3,13.34 C21.U1 | v69.85,93.34 69.85,93.98 76.2,100.33 76.2,107.95 v80.01,111.76 | v74.3,179.07 74.3,250.19 48.26,276.23 43.81,271.78 41.27,271.78 40.01,270.51 D20.C1
  Bottom 0.254: v76.2,59.69 76.2,87 v69.85,93.34 | v80.01,111.76 81.28,113.03 81.28,172.09 v74.3,179.07
C32H2  (via drill 0.61)
  Top 0.254: v44.45,67.94 44.45,69.85 v53.34,78.74 | v31.75,99.69 31.75,102.23 41.91,112.39 44.45,112.39 45.72,113.67 C32.H2
  Bottom 0.254: v44.45,67.94 52.07,60.33 52.07,57.78 D31.C1 | v53.34,78.74 36.83,95.25 36.2,95.25 v31.75,99.69
DATA00LL  (via drill 0.61)
  Top 0.254: v57.15,83.82 30.48,57.15 30.48,54.61 D22.D2 | v33.02,123.83 33.02,124.46 38.1,129.54 38.1,131.44 39.37,132.72 C22.A1 39.37,133.99 42.55,137.16 27.3,152.4 27.3,153.03 67.94,193.68 v67.94,226.06
  Bottom 0.254: D21.D1 48.9,267.33 47.62,268.61 45.09,268.61 43.81,269.88 41.27,267.33 41.27,259.71 61.59,239.4 61.59,235.59 A27.R1 62.23,234.31 62.23,231.78 v67.94,226.06 | v57.15,83.82 57.15,86.36 40.64,102.87 36.2,102.87 34.92,104.14 34.92,105.41 36.2,106.68 41.27,106.68 45.72,111.12 v33.02,123.83
DATA01L  (via drill 0.61)
  Top 0.254: v28.57,53.34 28.57,56.52 v66.67,94.61 68.58,96.52 68.58,97.79 72.39,101.6 72.39,107.95 81.28,116.84 81.28,141.6 v74.3,148.59 | v36.83,186.69 63.5,213.36 63.5,226.06 64.77,227.33 64.77,231.14 A27.S1
  Bottom 0.254: A27.S1 65.41,232.41 67.31,232.41 74.3,239.4 53.98,259.71 53.98,261.62 52.7,262.89 D21.E1 | v28.57,53.34 30.48,51.44 33.02,51.44 D22.E2 | v66.67,94.61 66.67,95.89 40.64,121.92 38.1,121.92 36.83,123.19 C22.D1 | v36.83,186.69 36.83,186.06 v74.3,148.59
DATA02L  (via drill 0.61)
  Top 0.254: A27.U1 65.41,226.06 65.41,229.87 66.67,231.14 66.67,238.76 53.34,252.09 52.7,251.46 D21.K1 | v38.1,57.15 38.1,53.34 33.02,48.26 30.48,48.26 D22.F2 | v36.83,68.58 36.83,73.66 v41.27,78.11 | v27.94,97.16 27.94,100.33 28.57,100.97 28.57,105.41 v38.1,114.94 | v69.85,207.65 69.85,177.16 50.16,157.48 50.16,155.57 47.62,153.03 47.62,137.79 38.1,128.27 38.1,123.19 37.47,122.56 36.83,122.56 v34.92,120.65
  Bottom 0.254: v38.1,57.15 38.1,67.31 v36.83,68.58 | v41.27,78.11 41.27,83.82 v27.94,97.16 | v38.1,114.94 38.1,115.57 36.83,116.84 C22.F1 36.2,118.11 34.92,119.38 v34.92,120.65 | v69.85,207.65 65.41,212.09 65.41,224.79 A27.U1
DATA03L  (via drill 0.61)
  Top 0.254: v76.83,98.42 v29.21,50.8 | v66.67,113.67 66.67,117.47 78.11,128.91 78.11,136.53 80.64,139.06 74.3,145.41 73.03,144.15 | 73.03,144.15 41.91,113.03 38.1,113.03 36.83,111.76 C22.J1 | v40.64,196.85 61.59,217.81 61.59,221.62 A27.V1 | v80.01,155.57 73.03,148.59 73.03,144.15
  Bottom 0.254: A27.V1 61.59,222.88 61.59,225.43 45.72,241.3 45.72,242.57 44.45,243.84 44.45,245.11 48.26,248.92 48.9,248.28 D21.L1 | v29.21,50.8 33.02,46.99 33.02,45.09 D22.H2 | v76.83,98.42 76.83,103.5 v66.67,113.67 | v40.64,196.85 40.64,196.22 45.09,191.77 45.09,190.5 v80.01,155.57
DATA04L  (via drill 0.61)
  Top 0.254: v71.12,202.56 71.12,172.09 66.04,167 63.5,167 62.23,165.74 B27.R1 | v45.72,36.2 46.35,36.2 53.98,43.81 53.98,48.9 v63.5,58.42 | v67.94,156.21 67.94,146.05 v60.96,139.06 | v68.58,127 47.62,106.05 v47.62,102.23
  Bottom 0.254: v71.12,202.56 64.14,209.55 64.14,217.81 50.8,231.14 50.8,232.41 49.53,233.68 49.53,234.31 D21.R1 | v45.72,36.2 42.55,39.37 34.92,39.37 33.66,40.64 30.48,40.64 D22.J2 | v63.5,58.42 63.5,81.28 47.62,97.16 | 47.62,97.16 41.27,103.5 37.47,103.5 36.83,104.14 C22.L1 | v67.94,156.21 62.23,161.93 62.23,164.47 B27.R1 | v60.96,139.06 60.96,134.62 v68.58,127 | v47.62,102.23 47.62,97.16
DATA05L  (via drill 0.61)
  Top 0.254: v44.45,50.8 44.45,46.99 36.2,38.73 33.66,38.73 D22.K2 | v58.42,73.66 v44.45,59.69 | v25.4,203.84 26.67,205.1 27.94,205.1 52.07,229.24 52.07,231.14 D21.S1 | v60.33,83.19 60.33,86.36 64.14,90.17 64.77,90.17 75.56,100.97 75.56,108.58 v80.01,113.03
  Bottom 0.254: v44.45,59.69 v44.45,50.8 | v58.42,73.66 58.42,78.74 57.78,79.38 | 57.78,79.38 40.64,96.52 38.1,96.52 36.83,97.79 C22.N1 | v25.4,203.84 25.4,199.39 35.56,189.23 40.01,189.23 63.5,165.74 63.5,163.83 64.77,162.56 B27.S1 65.41,161.29 78.11,148.59 78.11,139.06 80.64,136.53 80.64,125.09 80.01,124.46 v80.01,113.03 | 57.78,79.38 60.96,82.55 v60.33,83.19
DATA06L  (via drill 0.61)
  Top 0.254: v60.33,67.94 30.48,38.1 30.48,35.56 D22.L2 | v79.38,125.09 79.38,118.11 v45.72,84.45 | v38.1,182.88 66.67,211.46 66.67,226.06 73.66,233.04 73.66,240.66 64.77,249.56 64.14,248.92 60.96,248.92 59.69,247.65 50.8,256.54 46.35,256.54 D21.H2
  Bottom 0.254: v60.33,67.94 60.33,70.48 45.72,85.09 | 45.72,85.09 40.64,90.17 38.1,90.17 36.83,91.44 C22.R1 | 65.41,153.03 65.41,149.86 78.11,137.16 78.11,135.25 78.74,134.62 78.74,128.27 79.38,127.64 v79.38,125.09 | 65.41,153.03 65.41,154.94 B27.U1 | v45.72,84.45 45.72,85.09 | v38.1,182.88 38.1,180.34 65.41,153.03
DATA07L  (via drill 0.61)
  Top 0.254: v57.15,53.34 36.2,32.38 33.66,32.38 D22.M2 | v80.01,212.72 80.01,175.9 78.74,174.62 78.74,171.45 63.5,156.21 63.5,154.31 62.23,153.03 B27.V1 | v59.05,70.48 80.64,92.08 80.64,93.34 81.28,93.98 81.28,107.95 v80.01,109.22 | v70.48,118.75 70.48,120.02 v78.11,127.64
  Bottom 0.254: v57.15,53.34 57.15,56.52 50.8,62.87 50.8,64.77 | 50.8,64.77 36.83,78.74 C22.V1 | v80.01,212.72 50.8,241.94 50.8,248.28 45.72,253.37 43.18,253.37 D21.J2 | 50.8,64.77 57.78,71.75 v59.05,70.48 | v70.48,118.75 v80.01,109.22 | v78.11,127.64 78.11,133.99 77.47,134.62 77.47,136.53 62.23,151.76 B27.V1
DATA08L  (via drill 0.61)
  Top 0.254: v36.83,126.36 33.66,123.19 33.66,121.28 C22.E2 | v3.17,203.84 38.73,239.4 41.27,239.4 42.55,240.66 D21.N2 | v11.43,55.88 10.16,55.88 9.53,55.24 8.26,55.24 5.71,52.7 3.81,52.7 1.27,55.24 1.27,79.38 5.08,83.19 1.91,86.36 1.91,112.39 v28.57,139.06
  Bottom 0.254: D27.R1 61.59,22.86 60.33,24.13 57.78,24.13 54.61,27.3 35.56,27.3 34.92,27.94 30.48,27.94 D22.N2 29.84,29.21 29.84,33.02 12.7,50.16 12.7,54.61 v11.43,55.88 | v36.83,126.36 36.83,127.64 31.75,132.72 31.75,135.89 v28.57,139.06 6.35,161.29 6.35,179.07 5.71,179.71 5.71,180.97 3.17,183.51 v3.17,203.84
DATA09L  (via drill 0.61)
  Top 0.254: 31.11,114.94 29.21,114.94 26.67,117.47 v30.48,121.28 | 31.11,114.94 33.02,114.94 C22.H2 | v22.23,142.88 22.23,153.03 29.21,160.02 29.21,161.93 34.92,167.64 34.92,178.44 v63.5,207.01 | v5.71,90.17 v5.71,87.63 | v6.35,102.23 6.99,102.87 18.41,102.87 26.04,110.49 26.67,110.49 31.11,114.94
  Bottom 0.254: D27.S1 64.77,19.68 63.5,20.95 60.96,20.95 58.42,23.5 57.15,23.5 56.52,24.13 38.73,24.13 38.1,24.77 33.66,24.77 D22.P2 33.02,26.04 30.48,26.04 28.57,27.94 28.57,33.02 12.06,49.53 12.06,50.8 6.35,56.52 6.35,69.22 11.43,74.3 12.06,73.66 15.24,73.66 15.88,73.03 17.14,74.3 15.88,75.56 12.7,75.56 6.35,81.92 6.35,87 v5.71,87.63 | v30.48,121.28 25.4,126.36 25.4,139.7 v22.23,142.88 | v63.5,207.01 63.5,217.17 50.16,230.5 50.16,231.78 47.62,234.31 47.62,236.22 46.35,237.49 D21.P2 | v5.71,90.17 8.26,92.71 6.35,94.61 v6.35,102.23
DATA10L  (via drill 0.61)
  Top 0.254: v11.43,71.12 29.21,88.9 25.4,92.71 26.67,93.98 27.94,93.98 28.57,94.61 28.57,95.25 29.84,96.52 28.57,97.79 28.57,99.06 31.11,101.6 31.11,102.87 33.02,104.78 33.02,107.31 C22.K2 | v15.88,57.78 15.88,48.26 v12.7,45.09 10.79,43.18 v2.54,43.18 | v1.91,196.22 29.84,224.16 40.64,224.16 41.27,224.79 45.72,224.79 D21.U2
  Bottom 0.254: 33.02,21.59 34.92,21.59 35.56,20.95 54.61,20.95 60.96,14.61 63.5,14.61 64.77,13.34 D27.U1 | 33.02,21.59 30.48,21.59 D22.R2 | v11.43,71.12 11.43,62.23 v15.88,57.78 | v12.7,45.09 12.7,41.91 33.02,21.59 | v1.91,196.22 1.91,156.84 1.27,156.21 1.27,44.45 v2.54,43.18
DATA11L  (via drill 0.61)
  Top 0.254: 33.02,99.06 33.02,97.16 31.75,95.89 31.75,89.53 22.23,80.01 22.23,76.83 16.51,71.12 16.51,67.94 v3.17,54.61 | 33.02,99.06 33.02,100.97 C22.M2 | v80.64,173.99 80.64,163.83 79.38,162.56 79.38,156.21 41.27,118.11 v41.27,114.3 | v41.27,107.95 41.27,107.31 33.02,99.06
  Bottom 0.254: 43.18,11.43 37.47,17.14 34.92,17.14 33.66,18.41 D22.S2 | 43.18,11.43 51.44,3.17 57.15,8.89 61.59,8.89 D27.V1 | v3.17,54.61 3.17,45.09 12.7,35.56 12.7,31.11 32.38,11.43 43.18,11.43 | v80.64,173.99 43.18,211.46 43.18,221.62 D21.V2 | v41.27,114.3 v41.27,107.95
GND  (via drill 0.61)
  Top 0.254: D32.U2 71.75,13.34 72.39,13.34 74.3,15.24 D32.T1 74.3,16.51 74.3,21.59 D32.R1 74.3,22.86 74.3,27.94 | 67.94,27.94 66.67,26.67 64.14,26.67 53.98,16.51 49.53,16.51 D31.T1 | 67.94,27.94 67.94,22.86 D32.R2 | D32.N2 67.94,27.94 | 74.3,27.94 68.58,27.94 D32.N2 | 74.3,27.94 D32.N1 | D32.A1 77.47,62.87 77.47,57.78 D32.C1 77.47,56.52 77.47,52.7 71.75,46.99 | 22.23,17.14 22.86,17.14 23.5,16.51 C21.T1 | 22.23,17.14 16.51,17.14 15.88,16.51 11.43,16.51 C20.T1 | D32.J2 67.94,40.64 67.94,35.56 D32.L2 67.94,34.29 67.94,29.21 D32.N2 | 71.75,46.99 68.58,46.99 D32.F2 | 71.75,46.99 74.3,46.99 D32.F1 | 33.66,42.55 v33.02,42.55 | 33.66,42.55 44.45,53.34 44.45,55.24 45.72,56.52 D31.C2 | 22.23,17.14 22.23,31.11 33.66,42.55 | A02.U2 8.26,226.06 8.89,226.06 10.79,227.97 A02.T1 10.79,229.24 10.79,234.31 A02.R1 11.43,234.31 17.14,234.31 D02.R2 17.78,234.31 23.5,234.31 | D21.V1 49.53,222.88 50.16,222.88 52.07,224.79 D21.U1 | D02.U2 20.95,226.06 21.59,226.06 23.5,227.97 D02.T1 23.5,229.24 23.5,234.31 | D02.N1 23.5,240.66 23.5,235.59 D02.R1 23.5,234.31 | A02.C2 8.26,269.24 13.97,269.24 A02.C1 | A02.C1 14.61,269.24 20.32,269.24 D02.C2 20.95,269.24 26.67,269.24 D02.C1 | A02.A1 13.97,275.59 13.97,270.51 A02.C1 | D02.C1 26.67,270.51 26.67,275.59 D02.A1 | D20.C2 33.02,269.24 27.3,269.24 D02.C1 | A02.R2 4.45,235.59 4.45,240.66 A02.N2 | A02.N2 4.45,241.94 4.45,247.01 A02.L2 4.45,248.28 4.45,253.37 A02.J2 4.45,254.63 4.45,259.71 A02.F2 5.08,259.71 10.79,259.71 A02.F1 11.43,259.71 17.14,259.71 D02.F2 | 17.14,245.11 17.14,247.01 D02.L2 | 17.14,245.11 17.14,241.94 D02.N2 | A02.K1 14.61,251.46 16.51,253.37 17.14,253.37 D02.J2 17.78,254.63 19.05,255.91 21.59,255.91 23.5,257.81 23.5,259.71 D02.F1
  Top 0.254: 17.14,245.11 22.23,250.19 26.67,250.19 D02.K1 | A02.N1 10.79,240.66 5.08,240.66 A02.N2 | 9.53,199.39 13.97,199.39 A03.C1 | 9.53,199.39 8.26,199.39 A03.C2 | D03.C2 20.32,199.39 14.61,199.39 A03.C1 | A03.A1 13.97,205.74 13.97,200.66 A03.C1 | A03.N2 4.45,172.09 4.45,177.16 A03.L2 4.45,178.44 4.45,183.51 A03.J2 4.45,184.78 4.45,189.87 A03.F2 5.08,189.87 9.53,189.87 | 9.53,189.87 10.79,189.87 A03.F1 11.43,189.87 17.14,189.87 | 9.53,199.39 9.53,189.87 | D03.U2 20.95,156.21 21.59,156.21 23.5,158.12 D03.T1 | C31.T1 48.9,158.12 44.45,158.12 43.81,157.48 37.47,157.48 36.83,158.12 C30.T1 | C30.C2 33.02,199.39 27.3,199.39 D03.C1 26.67,199.39 26.67,195.58 20.95,189.87 | A03.U2 8.26,156.21 8.89,156.21 10.79,158.12 A03.T1 10.79,159.38 10.79,164.47 A03.R1 | A03.K1 14.61,181.61 16.51,183.51 17.14,183.51 D03.J2 17.14,184.78 17.14,189.87 | 20.95,189.87 17.78,189.87 D03.F2 17.14,189.87 | 20.95,189.87 23.5,189.87 D03.F1 | D03.K1 26.67,180.34 22.23,180.34 21.59,179.71 19.05,179.71 17.78,178.44 D03.L2 | A03.N1 11.43,170.81 17.14,170.81 D03.N2 17.78,170.81 23.5,170.81 D03.N1 | A04.U2 8.26,83.19 8.89,83.19 10.79,85.09 A04.T1 11.43,86.36 11.43,88.27 13.34,90.17 15.88,90.17 17.14,91.44 D04.R2 17.78,91.44 23.5,91.44 D04.R1 | A04.C2 8.26,126.36 13.97,126.36 A04.C1 13.97,127.64 13.97,132.72 A04.A1 | 25.4,126.36 26.67,126.36 D04.C1 | 25.4,126.36 20.95,126.36 D04.C2 | C22.C2 33.02,126.36 32.38,126.36 30.48,124.46 C22.D2 | v41.27,125.09 44.45,128.27 45.09,127.64 45.72,127.64 C32.C2 | D04.U2 20.95,83.19 21.59,83.19 23.5,85.09 D04.T1 | v33.66,84.45 34.29,85.09 36.2,85.09 C22.T1 | A04.N1 10.79,97.79 10.79,92.71 A04.R1 10.79,91.44 5.08,91.44 A04.R2 4.45,92.71 4.45,97.79 A04.N2 4.45,99.06 4.45,104.14 A04.L2 4.45,105.41 4.45,110.49 A04.J2
  Top 0.254: A04.K1 14.61,108.58 15.24,108.58 17.14,110.49 D04.J2 17.14,111.76 17.14,116.84 | 17.14,116.84 11.43,116.84 A04.F1 | 17.14,116.84 D04.F2 17.78,116.84 23.5,116.84 D04.F1 24.13,118.11 25.4,119.38 25.4,126.36
  Bottom 0.254: D32.C2 71.75,56.52 77.47,56.52 D32.C1 | 19.68,55.88 13.34,55.88 12.06,57.15 C20.C2 | 19.68,55.88 20.32,56.52 C21.C2 | 49.53,51.44 64.14,36.83 66.67,36.83 67.94,35.56 D32.L2 | 49.53,51.44 46.35,54.61 46.35,56.52 D31.C2 | 67.94,43.81 67.94,41.91 D32.J2 | 67.94,43.81 67.94,46.99 D32.F2 | 67.94,43.81 73.03,38.73 77.47,38.73 D32.K1 | v33.02,42.55 19.68,55.88 | A02.N1 10.79,240.66 10.79,235.59 A02.R1 | D21.U1 52.07,226.06 50.16,227.97 49.53,227.97 D21.T1 48.9,229.24 44.45,229.24 43.81,229.87 36.2,229.87 | 36.2,229.87 36.2,231.14 27.94,239.4 25.4,239.4 24.13,240.66 D02.N1 | 36.2,229.87 36.2,229.24 D20.T1 | D21.C2 45.72,270.51 41.27,270.51 40.64,271.14 34.29,271.14 33.66,270.51 D20.C2 | A02.K1 14.61,250.19 15.24,250.19 17.14,248.28 D02.L2 | D02.F2 17.14,259.71 17.14,254.63 D02.J2 | A02.C2 8.26,269.24 8.26,265.43 9.53,264.16 9.53,262.25 10.79,260.99 A02.F1 | A03.R2 4.45,165.74 4.45,170.81 A03.N2 | D03.T1 23.5,159.38 23.5,164.47 D03.R1 23.5,165.74 23.5,167.64 | 23.5,167.64 23.5,170.81 D03.N1 | 23.5,167.64 31.75,159.38 36.2,159.38 C30.T1 | 26.67,201.29 26.67,205.74 D03.A1 | 26.67,201.29 26.67,200.66 D03.C1 | 26.67,201.29 40.64,201.29 41.27,200.66 45.72,200.66 C31.C2 | A03.N1 10.79,170.81 10.79,165.74 A03.R1 | D03.R2 17.14,165.74 17.14,170.81 D03.N2 17.14,172.09 17.14,177.16 D03.L2 17.14,178.44 15.24,180.34 14.61,180.34 A03.K1 | 33.02,59.69 33.02,57.78 D22.C2 | 33.02,59.69 12.06,80.64 9.53,80.64 8.26,81.92 A04.U2 | C22.D2 29.84,124.46 29.21,124.46 27.3,126.36 D04.C1 26.67,127.64 26.67,132.72 D04.A1 | v41.27,125.09 34.92,125.09 33.66,126.36 C22.C2 | A04.C1 14.61,127.64 20.32,127.64 D04.C2
  Bottom 0.254: 17.14,97.16 17.14,97.79 D04.N2 | 17.14,97.16 17.14,92.71 D04.R2 | D04.T1 23.5,86.36 23.5,91.44 D04.R1 24.13,91.44 25.4,90.17 27.94,90.17 v33.66,84.45 | A04.J2 4.45,111.76 4.45,116.84 A04.F2 5.08,116.84 10.79,116.84 A04.F1 | A04.K1 13.97,107.31 15.88,105.41 17.14,105.41 D04.L2 17.78,104.14 19.05,102.87 21.59,102.87 22.23,102.23 22.23,100.97 23.5,99.69 23.5,99.06 D04.N1 | D04.K1 26.67,108.58 26.67,110.49 24.77,112.39 24.77,116.2 24.13,116.84 D04.F1 | 17.14,97.16 12.06,97.16 11.43,97.79 A04.N1 | A03.U2 8.26,154.94 8.26,139.7 13.97,133.99 A04.A1 | A02.U2 8.26,224.79 8.26,212.72 13.97,207.01 A03.A1 | 49.53,51.44 45.72,47.62 39.37,53.98 38.73,53.98 33.02,59.69
IRQL
  Top 0.254: C22.S2 33.66,89.53 33.66,93.34 41.27,100.97 41.27,102.87 42.55,104.14 C32.L2
  Bottom 0.254: C27.P1 64.77,95.89 60.96,95.89 47.62,109.22 45.09,109.22 41.91,106.05 42.55,105.41 C32.L2
MD09L  (via drill 0.61)
  Top 0.254: v50.16,30.48 55.24,30.48 57.78,33.02 60.33,33.02 61.59,34.29 D27.L1
  Bottom 0.254: v50.16,30.48 43.81,36.83 32.38,36.83 29.21,40.01 27.94,40.01 17.78,50.16 14.61,50.16 C20.E1
MD10L  (via drill 0.61)
  Top 0.254: v31.11,11.43 42.55,11.43 60.96,29.84 63.5,29.84 64.77,31.11 D27.M1
  Bottom 0.254: v31.11,11.43 11.43,31.11 11.43,34.29 C20.L1
MD11L  (via drill 0.61)
  Top 0.254: v29.84,7.62 49.53,7.62 63.5,21.59 63.5,23.5 64.77,24.77 D27.P1
  Bottom 0.254: v29.84,7.62 19.05,18.41 14.61,18.41 C20.S1
N$1
  Top 0.254: D20.B1 36.83,273.69 41.27,273.69 45.09,277.5 51.44,277.5 52.07,276.86 D21.A1
N$2
  Top 0.254: D20.E1 40.01,264.16 42.55,264.16 47.62,269.24 47.62,271.14 48.9,272.42 D21.B1
N$3
  Top 0.254: D20.H1 39.37,256.54 39.37,252.73 38.1,251.46 38.1,249.56 39.37,248.28 41.27,250.19 41.27,254.63 45.09,258.44 47.62,258.44 48.9,259.71 D21.F1
N$4
  Top 0.254: D20.K1 40.01,251.46 40.01,254.63 44.45,259.08 45.72,259.08 48.26,261.62 50.16,261.62 53.34,258.44 52.7,257.81 D21.H1
N$5
  Top 0.254: D20.P1 40.01,238.76 44.45,238.76 45.09,239.4 47.62,239.4 48.9,240.66 D21.N1
N$6
  Top 0.254: D20.M1 40.01,243.84 44.45,243.84 46.99,241.3 48.26,242.57 50.8,242.57 52.07,243.84 D21.M1
N$7
  Top 0.254: 7.62,35.56 7.62,37.47 C20.K2 | 7.62,35.56 7.62,32.38 C20.M2 | 7.62,35.56 26.67,54.61 26.67,56.52 C21.C1
N$8
  Bottom 0.254: D20.N2 30.48,240.66 30.48,238.76 35.56,233.68 44.45,233.68 45.72,232.41 D21.S2
N$9  (via drill 0.61)
  Top 0.254: v44.45,127 43.18,125.73 43.18,124.46 C32.D2 | v80.01,93.98 80.01,92.71 57.78,70.48 57.78,69.22 52.7,64.14 D31.A1
  Bottom 0.254: D31.A1 52.7,62.87 57.15,62.87 64.14,55.88 66.67,55.88 67.94,54.61 D32.D2 | v44.45,127 44.45,128.27 45.72,129.54 59.69,115.57 60.96,115.57 71.12,105.41 71.12,102.87 v80.01,93.98
N$10
  Bottom 0.254: D20.J2 30.48,253.37 34.92,253.37 38.73,249.56 41.27,249.56 42.55,248.28 D21.L2
N$11  (via drill 0.61)
  Top 0.254: v60.33,243.84 42.55,226.06 40.01,226.06 D20.U1
  Bottom 0.254: v60.33,243.84 60.33,251.46 50.16,261.62 47.62,261.62 46.35,262.89 D21.E2
N$12  (via drill 0.61)
  Top 0.254: v57.15,247.01 42.55,232.41 40.01,232.41 D20.S1
  Bottom 0.254: v57.15,247.01 57.15,250.19 44.45,262.89 44.45,264.8 43.18,266.06 D21.D2
N$13
  Bottom 0.254: D20.F2 30.48,259.71 34.92,259.71 41.91,252.73 44.45,252.73 45.72,251.46 D21.K2
N$14
  Bottom 0.254: D20.L2 30.48,247.01 33.02,247.01 41.27,238.76 41.27,236.85 42.55,235.59 D21.R2
N$15  (via drill 0.61)
  Top 0.254: D31.D1 49.53,54.61 52.7,54.61 v56.52,58.42 78.11,80.01 v78.11,87.63 | v48.9,115.57 49.53,115.57 v55.88,121.92 | v73.66,107.95 73.66,101.6 v69.85,97.79
  Bottom 0.254: v56.52,58.42 60.33,58.42 63.5,55.24 64.77,55.24 67.31,52.7 69.85,52.7 71.12,51.44 D32.E2 | v48.9,115.57 46.35,118.11 46.35,120.02 C32.E2 | v55.88,121.92 59.69,121.92 v73.66,107.95 | v69.85,97.79 69.85,95.89 v78.11,87.63
N$16  (via drill 0.61)
  Top 0.254: v59.69,40.01 64.77,40.01 67.31,42.55 69.85,42.55 71.12,43.81 D32.H2 | v52.7,125.09 45.72,118.11 43.18,118.11 C32.F2 | v78.11,104.78 78.11,97.16 v65.41,84.45
  Bottom 0.254: v59.69,40.01 52.7,46.99 49.53,46.99 D31.F1 | v52.7,125.09 57.78,125.09 v78.11,104.78 | v65.41,84.45 66.67,83.19 66.67,57.78 73.03,51.44 73.03,46.35 71.75,45.09 D32.H2
N$17  (via drill 0.61)
  Top 0.254: v50.8,87.63 50.8,83.19 v38.1,70.48
  Bottom 0.254: 71.12,35.56 72.39,36.83 71.75,37.47 D32.K2 | 71.12,35.56 66.04,30.48 51.44,30.48 49.53,32.38 49.53,34.29 D31.L1 | v50.8,87.63 43.18,95.25 43.18,97.79 C32.N2 | v38.1,70.48 38.1,68.58 71.12,35.56
N$18  (via drill 0.61)
  Top 0.254: v17.78,70.48 17.78,71.12 v75.56,128.91 | 41.27,173.99 41.27,182.25 42.55,183.51 C31.J2 | v41.27,169.54 41.27,173.99 | 41.27,173.99 48.9,181.61 48.9,183.51 C31.J1 49.53,184.78 50.16,185.42 v50.16,187.32
  Bottom 0.254: v17.78,70.48 49.53,38.73 52.07,38.73 D31.K1 | v75.56,128.91 75.56,135.25 v41.27,169.54 | v50.16,187.32 46.35,191.13 46.35,193.04 C31.E2
N$19
  Bottom 0.254: C21.F1 23.5,48.26 22.86,48.26 20.95,50.16 C21.E2
N$20  (via drill 0.61)
  Top 0.254: v27.94,41.27 27.3,40.64 27.3,38.73 C21.K1
  Bottom 0.254: v27.94,41.27 19.05,50.16 19.05,52.07 17.78,53.34 C21.D2
N$21
  Top 0.254: C31.D1 49.53,197.49 50.16,197.49 52.07,199.39 C31.C1
N$22
  Top 0.254: C31.D2 43.18,197.49 45.72,197.49 47.62,199.39 47.62,201.29 48.9,202.56 C31.B1
  Bottom 0.254: C31.F1 48.9,191.13 48.9,193.04 46.99,194.94 44.45,194.94 43.18,196.22 C31.D2
N$23  (via drill 0.61)
  Top 0.254: v39.37,77.47 28.57,66.67 28.57,62.87 17.78,52.07 17.78,48.26 C21.F2
  Bottom 0.254: v39.37,77.47 39.37,78.74 37.47,80.64 34.92,80.64 33.66,81.92 C22.U2
N$24  (via drill 0.61)
  Top 0.254: v31.75,167.64 31.75,183.51 38.1,189.87 38.1,191.77 39.37,193.04 C30.E1
  Bottom 0.254: v31.75,167.64 39.37,160.02 43.81,160.02 45.09,158.75 43.81,157.48 35.56,157.48 34.92,158.12 30.48,158.12 C30.T2
N$25
  Bottom 0.254: C30.F1 36.83,191.13 40.64,191.13 42.55,193.04 44.45,191.13 44.45,189.87 46.35,187.96 C31.H2
N$26
  Bottom 0.254: C31.L2 43.18,177.16 43.81,177.16 45.72,175.26 C31.M2 46.35,173.99 48.26,172.09 48.9,172.09 C31.N1
N$28
  Top 0.254: C31.N2 43.18,172.09 43.18,174.62 49.53,180.97 49.53,182.25 50.8,183.51 50.8,185.42 52.07,186.69 C31.H1
N$29  (via drill 0.61)
  Top 0.254: v61.59,194.31 52.7,185.42 52.7,181.61 C31.K1
  Bottom 0.254: v61.59,194.31 61.59,194.94 53.98,202.56 53.98,204.47 52.7,205.74 C31.A1
N$30
  Top 0.254: C31.K2 46.35,181.61 46.35,185.42 50.8,189.87 50.8,191.77 52.07,193.04 C31.E1
OPAUSEL  (via drill 0.61)
  Top 0.254: v79.38,139.06 64.77,124.46 62.23,124.46 C27.D1
  Bottom 0.254: v79.38,139.06 79.38,151.76 44.45,186.69 44.45,188.59 43.18,189.87 C31.F2
PAUSEL  (via drill 0.61)
  Top 0.254: C21.J1 24.13,41.91 24.77,41.91 26.67,43.81 C21.H1 | D31.H1 52.07,43.81 50.16,41.91 49.53,41.91 D31.J1 48.9,40.64 48.26,40.01 v45.72,40.01
  Bottom 0.254: v45.72,40.01 35.56,40.01 34.29,41.27 33.02,41.27 30.48,43.81 27.3,43.81 C21.H1
POWEROK  (via drill 0.61)
  Top 0.254: v69.85,134.62 47.62,112.39 47.62,107.31 46.35,106.05 46.35,102.23 C32.M2
  Bottom 0.254: v69.85,134.62 69.85,137.79 55.88,151.76 B27.V2
SKIPL
  Top 0.254: C22.P2 33.66,95.89 33.66,97.79 41.91,106.05 44.45,106.05 45.72,107.31 C32.K2
  Bottom 0.254: C27.S1 64.77,89.53 60.96,89.53 56.52,93.98 56.52,95.25 47.62,104.14 47.62,106.05 46.35,107.31 C32.K2
STROBE  (via drill 0.61)
  Top 0.254: v19.05,67.94 19.05,71.12 v59.69,111.76 | v28.57,153.03 49.53,173.99 52.07,173.99 C31.M1 | v59.69,116.84 59.69,115.57 59.05,114.94 C27.H2
  Bottom 0.254: C31.M1 52.07,175.26 51.44,175.26 49.53,177.16 C31.L1 | v19.05,67.94 52.07,34.92 52.07,32.38 D31.M1 | v59.69,111.76 59.69,113.03 59.05,113.67 C27.H2 | v28.57,153.03 28.57,146.69 43.81,131.44 45.09,131.44 v59.69,116.84
T2  (via drill 0.61)
  Top 0.254: v10.16,89.53 9.53,88.9 9.53,88.27 7.62,86.36 5.08,86.36 A04.T2
  Bottom 0.254: v10.16,89.53 11.43,89.53 13.34,87.63 15.88,87.63 17.14,86.36 D04.T2
TP3  (via drill 0.61)
  Top 0.254: v78.74,92.71 49.53,63.5 49.53,60.96 D31.B1 | v63.5,111.76 63.5,115.57 v76.83,128.91
  Bottom 0.254: v78.74,92.71 70.48,100.97 70.48,104.78 v63.5,111.76 | v76.83,128.91 76.83,133.99 76.2,134.62 76.2,135.89 60.33,151.76 60.33,156.84 37.47,179.71 37.47,180.97 34.92,183.51 34.92,185.42 33.66,186.69 C30.H2
TP4  (via drill 0.61)
  Top 0.254: v79.38,80.01 52.7,53.34 52.7,51.44 D31.E1
  Bottom 0.254: v79.38,80.01 79.38,85.09 57.15,107.31 57.15,109.22 55.88,110.49 C27.J2
V2
  Top 0.254: A04.V2 5.08,78.74 10.79,73.03 17.14,79.38 D04.V2
VCC  (via drill 0.61)
  Top 0.254: v28.57,67.94 24.77,67.94 20.95,64.14 C21.A2 | 34.92,133.99 38.1,133.99 v41.27,137.16 | 34.92,133.99 33.66,133.99 C22.A2 | 34.92,133.99 34.92,142.88 29.21,148.59 22.23,141.6 21.59,141.6 15.24,147.96 28.57,161.29 28.57,186.69 44.45,202.56 44.45,204.47 45.72,205.74 C31.A2 | v80.01,95.25 59.69,74.93 58.42,74.93 47.62,64.14 46.35,64.14 D31.A2
  Bottom 0.254: 33.66,67.31 33.66,64.14 D22.A2 | 33.66,67.31 38.1,71.75 45.72,64.14 D31.A2 | C20.A2 8.26,64.14 8.26,69.22 11.43,72.39 20.32,63.5 C21.A2 | 33.66,67.31 29.21,67.31 v28.57,67.94 | D21.A2 45.72,276.23 39.37,282.57 33.66,276.86 D20.A2 33.02,276.86 28.57,276.86 27.94,277.5 13.34,277.5 1.27,265.43 1.27,236.22 6.99,230.5 11.43,230.5 34.29,207.65 | v41.27,137.16 42.55,137.16 45.72,133.99 C32.A2 46.35,132.72 47.62,131.44 50.16,131.44 53.34,128.27 59.69,128.27 80.01,107.95 v80.01,95.25 | 34.29,207.65 39.37,212.72 45.72,206.38 C31.A2 | 34.29,207.65 33.66,207.01 C30.A2